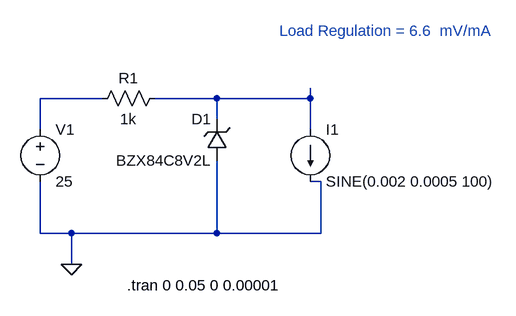
[diagram p0: schematic 20301378_Lab3_Regulator.asc]
20301378_Lab3_Regulator.asc, the LTspice schematic file:
Version 4
SHEET 1 880 680
WIRE -432 96 -528 96
WIRE -256 96 -352 96
WIRE -112 96 -112 80
WIRE -112 96 -256 96
WIRE -256 128 -256 96
WIRE -528 144 -528 96
WIRE -112 144 -112 96
WIRE -96 224 -112 224
WIRE -528 304 -528 224
WIRE -480 304 -528 304
WIRE -256 304 -256 192
WIRE -256 304 -480 304
WIRE -96 304 -96 224
WIRE -96 304 -256 304
WIRE -480 352 -480 304
FLAG -480 352 0
SYMBOL voltage -528 128 R0
WINDOW 123 0 0 Left 0
WINDOW 39 0 0 Left 0
SYMATTR InstName V1
SYMATTR Value 25
SYMBOL res -336 80 R90
WINDOW 0 0 56 VBottom 2
WINDOW 3 32 56 VTop 2
SYMATTR InstName R1
SYMATTR Value 1k
SYMBOL zener -240 192 R180
WINDOW 0 24 64 Left 2
WINDOW 3 24 0 Left 2
SYMATTR InstName D1
SYMATTR Value BZX84C8V2L
SYMBOL current -112 144 R0
WINDOW 123 0 0 Left 0
WINDOW 39 0 0 Left 0
SYMATTR InstName I1
SYMATTR Value SINE(0.002 0.0005 100)
TEXT -394 384 Left 2 !.tran 0 0.05 0 0.00001
TEXT -160 -8 Left 2 ;Load Regulation = 6.6  mV/mA

The netlist it stands for:
* 20301378_Lab3_Regulator.asc
V1 N001 0 25
R1 N002 N001 1k
D1 0 N002 BZX84C8V2L
I1 N002 0 SINE(0.002 0.0005 100)
.model D D
.lib standard.dio
.tran 0 0.05 0 0.00001
* Load Regulation = 6.6  mV/mA
.backanno
.end